# EAGLE schematic me433-hw6 (EAGLE 9.6.2)
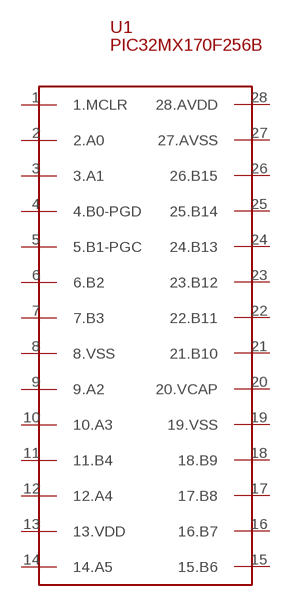
[diagram p0: schematic, sheet 1]

## Parts
U1  PIC32MX170F256B  [DIL28-3]
Unconnected: U1.1(1.MCLR) U1.2(2.A0) U1.3(3.A1) U1.4(4.B0-PGD) U1.5(5.B1-PGC) U1.6(6.B2) U1.7(7.B3) U1.8(8.VSS) U1.9(9.A2) U1.10(10.A3) U1.11(11.B4) U1.12(12.A4) U1.13(13.VDD) U1.14(14.A5) U1.15(15.B6) U1.16(16.B7) U1.17(17.B8) U1.18(18.B9) U1.19(19.VSS) U1.20(20.VCAP) U1.21(21.B10) U1.22(22.B11) U1.23(23.B12) U1.24(24.B13) U1.25(25.B14) U1.26(26.B15) U1.27(27.AVSS) U1.28(28.AVDD)

## Library data of the parts
U1 = hw6_lib:PIC32MX170F256B